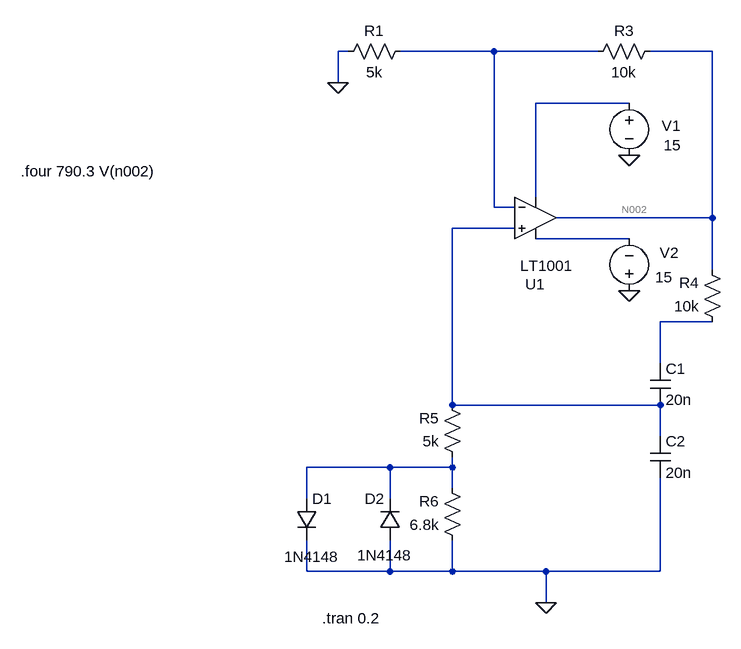
[diagram p0: schematic wbo.asc]
wbo.asc, the LTspice schematic file:
Version 4
SHEET 1 996 680
WIRE -272 -384 -288 -384
WIRE -48 -384 -192 -384
WIRE 112 -384 -48 -384
WIRE 288 -384 192 -384
WIRE -288 -336 -288 -384
WIRE 160 -304 16 -304
WIRE 16 -160 16 -304
WIRE -48 -144 -48 -384
WIRE -16 -144 -48 -144
WIRE 288 -128 288 -384
WIRE 288 -128 48 -128
WIRE -16 -112 -112 -112
WIRE 160 -96 16 -96
WIRE 288 -48 288 -128
WIRE 288 32 208 32
WIRE 208 96 208 32
WIRE -112 160 -112 -112
WIRE 208 160 -112 160
WIRE 208 208 208 160
WIRE -208 256 -336 256
WIRE -112 256 -112 240
WIRE -112 256 -208 256
WIRE -112 288 -112 256
WIRE -336 304 -336 256
WIRE -208 304 -208 256
WIRE -336 416 -336 368
WIRE -208 416 -208 368
WIRE -208 416 -336 416
WIRE -112 416 -112 368
WIRE -112 416 -208 416
WIRE 32 416 -112 416
WIRE 208 416 208 272
WIRE 208 416 32 416
WIRE 32 464 32 416
FLAG 160 -224 0
FLAG 160 -16 0
FLAG 32 464 0
FLAG -288 -336 0
SYMBOL OpAmps\\LT1001 16 -192 R0
WINDOW 0 -16 166 Left 2
WINDOW 3 -24 138 Left 2
SYMATTR InstName U1
SYMBOL voltage 160 -320 R0
WINDOW 0 50 50 Left 2
WINDOW 3 53 80 Left 2
WINDOW 123 0 0 Left 0
WINDOW 39 0 0 Left 0
SYMATTR InstName V1
SYMATTR Value 15
SYMBOL voltage 160 0 R180
WINDOW 0 -76 74 Left 2
WINDOW 3 -67 37 Left 2
WINDOW 123 0 0 Left 0
WINDOW 39 0 0 Left 0
SYMATTR InstName V2
SYMATTR Value 15
SYMBOL res -176 -400 R90
WINDOW 0 0 56 VBottom 2
WINDOW 3 32 56 VTop 2
SYMATTR InstName R1
SYMATTR Value 5k
SYMBOL res 208 -400 R90
WINDOW 0 0 56 VBottom 2
WINDOW 3 32 56 VTop 2
SYMATTR InstName R3
SYMATTR Value 10k
SYMBOL res 304 48 R180
WINDOW 0 36 76 Left 2
WINDOW 3 36 40 Left 2
SYMATTR InstName R4
SYMATTR Value 10k
SYMBOL res -96 256 R180
WINDOW 0 36 76 Left 2
WINDOW 3 36 40 Left 2
SYMATTR InstName R5
SYMATTR Value 5k
SYMBOL res -96 384 R180
WINDOW 0 36 76 Left 2
WINDOW 3 36 40 Left 2
SYMATTR InstName R6
SYMATTR Value 6.8k
SYMBOL cap 192 96 R0
SYMATTR InstName C1
SYMATTR Value 20n
SYMBOL cap 192 208 R0
SYMATTR InstName C2
SYMATTR Value 20n
SYMBOL diode -352 304 R0
WINDOW 3 -19 89 Left 2
SYMATTR Value 1N4148
SYMATTR InstName D1
SYMBOL diode -192 368 R180
WINDOW 0 24 64 Left 2
WINDOW 3 -18 -23 Left 2
SYMATTR InstName D2
SYMATTR Value 1N4148
TEXT -312 488 Left 2 !.tran 0.2
TEXT -776 -200 Left 2 !.four 790.3 V(n002)

The netlist it stands for:
* wbo.asc
XU1 N004 N001 N003 N005 N002 LT1001  ; pins In+ In- V+ V- OUT
V1 N003 0 15
V2 0 N005 15
R1 N001 0 5k
R3 N002 N001 10k
R4 N006 N002 10k
R5 N007 N004 5k
R6 0 N007 6.8k
C1 N006 N004 20n
C2 N004 0 20n
D1 N007 0 1N4148
D2 0 N007 1N4148
.model D D
.lib standard.dio
.tran 0.2
.four 790.3 V(n002)
.lib LTC.lib
.backanno
.end